# Altium schematic sheet NFC_Business_Card.SchDoc
size A4; SheetNumber: 1; SheetTotal: 1
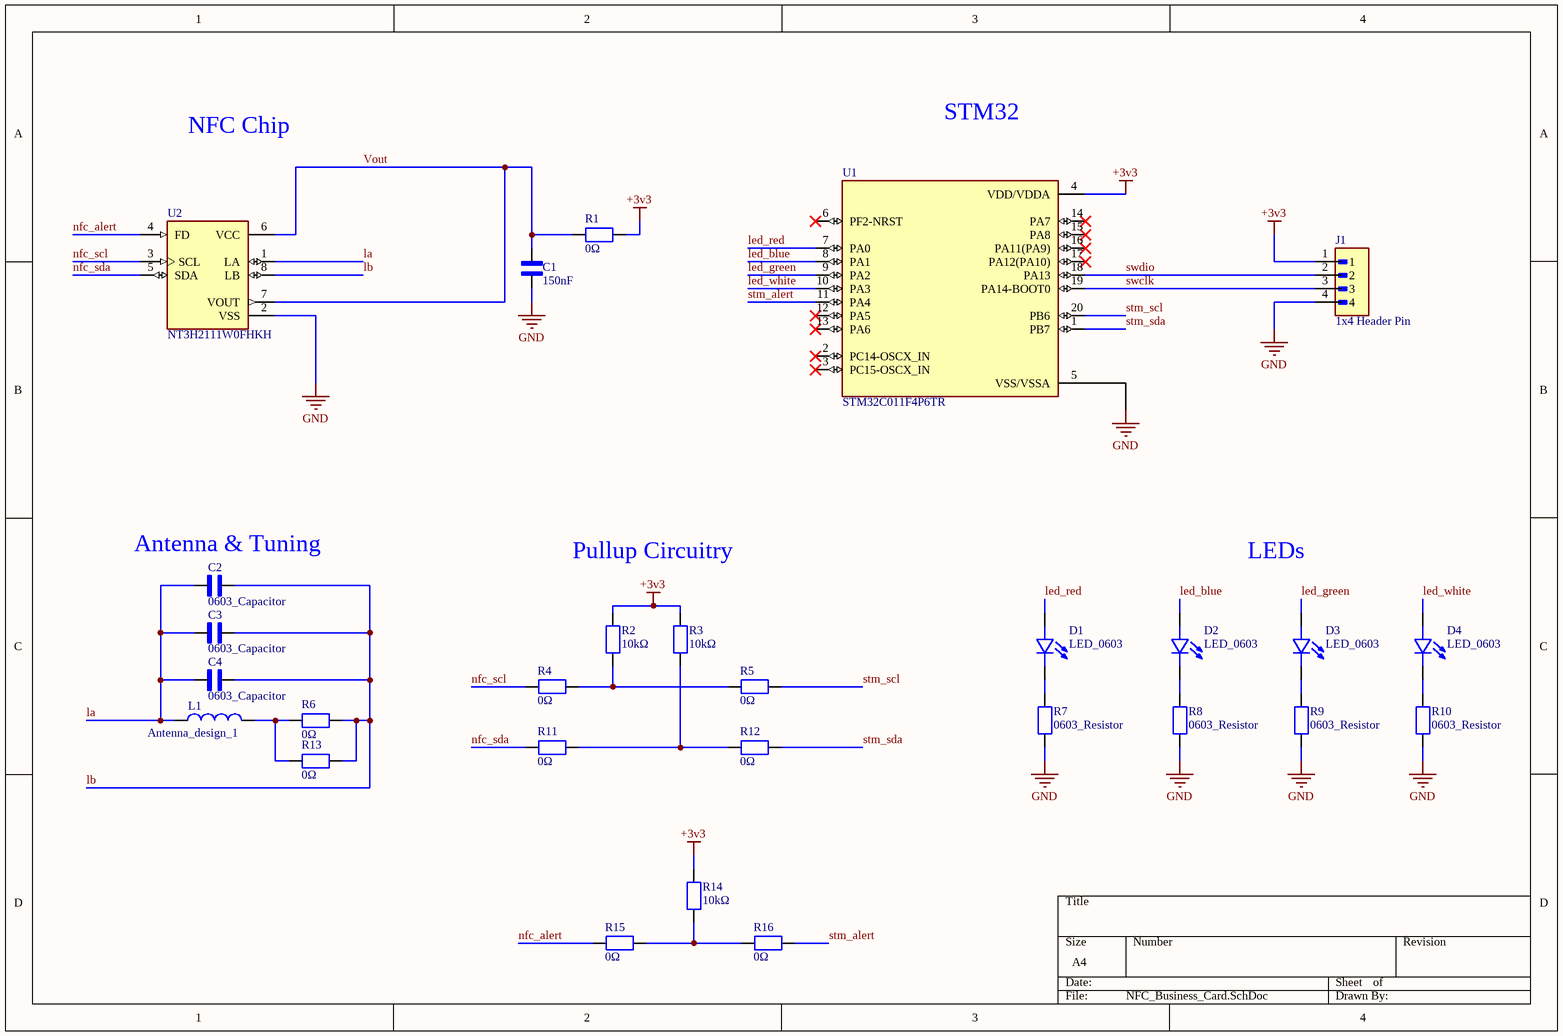
[diagram p0: NFC_Business_Card.SchDoc]

## Parts
C1  150nF  [0603 PACKAGE]
C2  0603_Capacitor  [0603 PACKAGE]
C3  0603_Capacitor  [0603 PACKAGE]
C4  0603_Capacitor  [0603 PACKAGE]
D1  LED_0603  [LED_KT-0603R]
D2  LED_0603  [LED_KT-0603R]
D3  LED_0603  [LED_KT-0603R]
D4  LED_0603  [LED_KT-0603R]
J1  1x4 Header Pin  [1x4 Jumper]
L1  Antenna_design_1  [ANTENNA_DESIGN2]
R1  0Ω  [0603 PACKAGE]
R2  10kΩ  [0603 PACKAGE]
R3  10kΩ  [0603 PACKAGE]
R4  0Ω  [0603 PACKAGE]
R5  0Ω  [0603 PACKAGE]
R6  0Ω  [0603 PACKAGE]
R7  0603_Resistor  [0603 PACKAGE]
R8  0603_Resistor  [0603 PACKAGE]
R9  0603_Resistor  [0603 PACKAGE]
R10  0603_Resistor  [0603 PACKAGE]
R11  0Ω  [0603 PACKAGE]
R12  0Ω  [0603 PACKAGE]
R13  0Ω  [0603 PACKAGE]
R14  10kΩ  [0603 PACKAGE]
R15  0Ω  [0603 PACKAGE]
R16  0Ω  [0603 PACKAGE]
U1  STM32C011F4P6TR  [SOP65P640X120-20N]
U2  NT3H2111W0FHKH  [QFN8P50_160X160X50L40X20N]

## Nets
+3v3: J1.1 R1.1 R2.1 R3.1 R14.1 U1.4(VDD/VDDA)
GND: C1.1 J1.4 R7.1 R8.1 R9.1 R10.1 U1.5(VSS/VSSA) U2.2(VSS)
la: C2.1 C3.1 C4.1 L1.1 U2.1(LA)
lb: C2.2 C3.2 C4.2 R6.1 R13.1 U2.8(LB)
led_blue: D2.A U1.8(PA1)
led_green: D3.A U1.9(PA2)
led_red: D1.A U1.7(PA0)
led_white: D4.A U1.10(PA3)
nfc_alert: R15.2 U2.4(FD)
nfc_scl: R4.2 U2.3(SCL)
nfc_sda: R11.2 U2.5(SDA)
stm_alert: R16.1 U1.11(PA4)
stm_scl: R5.1 U1.20(PB6)
stm_sda: R12.1 U1.1(PB7)
swclk: J1.3 U1.19(PA14-BOOT0)
swdio: J1.2 U1.18(PA13)
Vout: C1.2 R1.2 U2.6(VCC) U2.7(VOUT)
NetD1_C: D1.C R7.2
NetD2_C: D2.C R8.2
NetD3_C: D3.C R9.2
NetD4_C: D4.C R10.2
NetL1_2: L1.2 R6.2 R13.2
NetR2_2: R2.2 R4.1 R5.2
NetR3_2: R3.2 R11.1 R12.2
NetR14_2: R14.2 R15.1 R16.2

Not connected (* = marked no-connect by the designer): U1 2(PC14-OSCX_IN)* 3(PC15-OSCX_IN)* 6(PF2-NRST)* 12(PA5)* 13(PA6)* 14(PA7)* 15(PA8)* 16(PA11(PA9))* 17(PA12(PA10))*

## Notes on the sheet
- NFC Chip
- STM32
- (near C2) Antenna & Tuning
- Pullup Circuitry
- LEDs

## Library data of the parts
C1 = 0603_Capacitor
D1-D4 = LED_0603: Red 0603 Light Emitting Diodes; MF: Hubei KENTO Elec; MP: KT-0603R; SnapEDA_Link: https://www.snapeda.com/parts/KT-0603R/Hubei+KENTO+Elec/view-part/?ref=snap; Package: Package; Value: *; Check_prices: https://www.snapeda.com/parts/KT-0603R/Hubei+KENTO+Elec/view-part/?ref=eda
J1 = 1x4 Header Pin: 2.54mm (0.1) Pitch SIL Vertical Throughboard Pin Header, 7mm mating pin height, tin, 4 contacts; MF: Harwin; MP: M20-9730446; SnapEDA_Link: https://www.snapeda.com/parts/M20-9730446/Harwin/view-part/?ref=snap; Package: None; Value: *; Check_prices: https://www.snapeda.com/parts/M20-9730446/Harwin/view-part/?ref=eda
R1-R6 R11-R16 = 0603_Resistor
U1 = STM32C011F4P6TR: ARMÂ® CortexÂ®-M0+ STM32C0 Microcontroller IC 32-Bit 48MHz 16KB (16K x 8) FLASH 20-TSSOP; MF: STMicroelectronics; SnapEDA_Link: https://www.snapeda.com/parts/STM32C011F4P6TR/STMicroelectronics/view-part/?ref=snap; Package: None; Value: *; MP: STM32C011F4P6TR; Check_prices: https://www.snapeda.com/parts/STM32C011F4P6TR/STMicroelectronics/view-part/?ref=eda
U2 = NT3H2111W0FHKH: RFID Reader/Transponder IC 13.56MHz ISO 14443, NFC IÂ²C 1.67V ~ 3.6V 8-XFQFN Exposed Pad; MF: NXP USA; SnapEDA_Link: https://www.snapeda.com/parts/NT3H2111W0FHKH/NXP+Semiconductors/view-part/?ref=snap; Package: Package; Value: *; MP: NT3H2111W0FHKH; Check_prices: https://www.snapeda.com/parts/NT3H2111W0FHKH/NXP+Semiconductors/view-part/?ref=eda